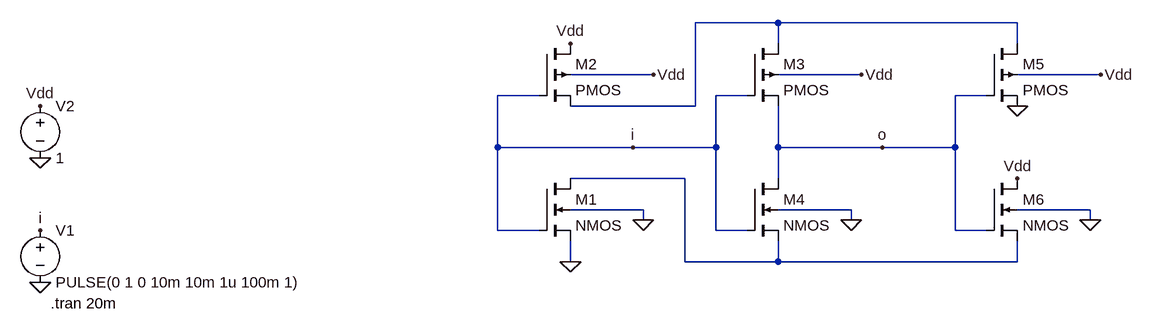
[diagram p0: schematic 1b-2.asc]
1b-2.asc, the LTspice schematic file:
Version 4
SHEET 1 1840 680
WIRE 1280 -208 1152 -208
WIRE 1648 -208 1280 -208
WIRE 1280 -176 1280 -208
WIRE 1648 -176 1648 -208
WIRE 1088 -128 960 -128
WIRE 1408 -128 1280 -128
WIRE 1776 -128 1648 -128
WIRE 912 -96 848 -96
WIRE 1232 -96 1184 -96
WIRE 1600 -96 1552 -96
WIRE 1152 -80 1152 -208
WIRE 1152 -80 960 -80
WIRE 848 -16 848 -96
WIRE 1056 -16 848 -16
WIRE 1184 -16 1184 -96
WIRE 1184 -16 1056 -16
WIRE 1280 -16 1280 -80
WIRE 1440 -16 1280 -16
WIRE 1552 -16 1552 -96
WIRE 1552 -16 1440 -16
WIRE 1136 32 960 32
WIRE 1280 32 1280 -16
WIRE 1072 80 960 80
WIRE 1392 80 1280 80
WIRE 1760 80 1648 80
WIRE 1072 96 1072 80
WIRE 1392 96 1392 80
WIRE 1760 96 1760 80
WIRE 848 112 848 -16
WIRE 912 112 848 112
WIRE 1184 112 1184 -16
WIRE 1232 112 1184 112
WIRE 1552 112 1552 -16
WIRE 1600 112 1552 112
WIRE 960 160 960 128
WIRE 1136 160 1136 32
WIRE 1280 160 1280 128
WIRE 1280 160 1136 160
WIRE 1648 160 1648 128
WIRE 1648 160 1280 160
FLAG 144 192 0
FLAG 960 160 0
FLAG 1440 -16 o
FLAG 1088 -128 Vdd
FLAG 1056 -16 i
FLAG 144 0 0
FLAG 144 -80 Vdd
FLAG 144 112 i
FLAG 960 -176 Vdd
FLAG 1072 96 0
FLAG 1408 -128 Vdd
FLAG 1392 96 0
FLAG 1776 -128 Vdd
FLAG 1760 96 0
FLAG 1648 32 Vdd
FLAG 1648 -80 0
SYMBOL voltage 144 96 R0
WINDOW 123 0 0 Left 0
WINDOW 39 0 0 Left 0
SYMATTR InstName V1
SYMATTR Value PULSE(0 1 0 10m 10m 1u 100m 1)
SYMBOL pmos4 912 -176 R0
SYMATTR InstName M2
SYMBOL nmos4 912 32 R0
SYMATTR InstName M1
SYMBOL voltage 144 -96 R0
WINDOW 123 0 0 Left 0
WINDOW 39 0 0 Left 0
SYMATTR InstName V2
SYMATTR Value 1
SYMBOL pmos4 1232 -176 R0
SYMATTR InstName M3
SYMBOL nmos4 1232 32 R0
SYMATTR InstName M4
SYMBOL pmos4 1600 -176 R0
SYMATTR InstName M5
SYMBOL nmos4 1600 32 R0
SYMATTR InstName M6
TEXT 160 224 Left 2 !.tran 20m

The netlist it stands for:
* 1b-2.asc
V1 i 0 PULSE(0 1 0 10m 10m 1u 100m 1)
M2 Vdd i N001 Vdd PMOS
M1 N002 i 0 0 NMOS
V2 Vdd 0 1
M3 N001 i o Vdd PMOS
M4 o i N002 0 NMOS
M5 N001 o 0 Vdd PMOS
M6 Vdd o N002 0 NMOS
.model NMOS NMOS
.model PMOS PMOS
.lib standard.mos
.tran 20m
.backanno
.end